# Altium schematic sheet Плакат.SchDoc
size 840 x 594 mm; Address1: Address1; Address2: Address2; Address3: Address3; Address4: Address4; SheetNumber: 1; Scale: 1:1; Разраб.: Иванов; Обозначение документа: АБВГ.123456.001 Э3; Пров.: Петров; Утв.: Сидоров; Наименование организации: ОАО "Концерн "МПО-Гидроприбор"; Перв. применение: АБВГ.123456.000; Наименование изделия 1: Плата; Наименование изделия 2: Схема электрическая; Наименование изделия 3: принципиальная; Нач. отд.: Нач. отд.; Фамилия нач. отд.: Сидоров
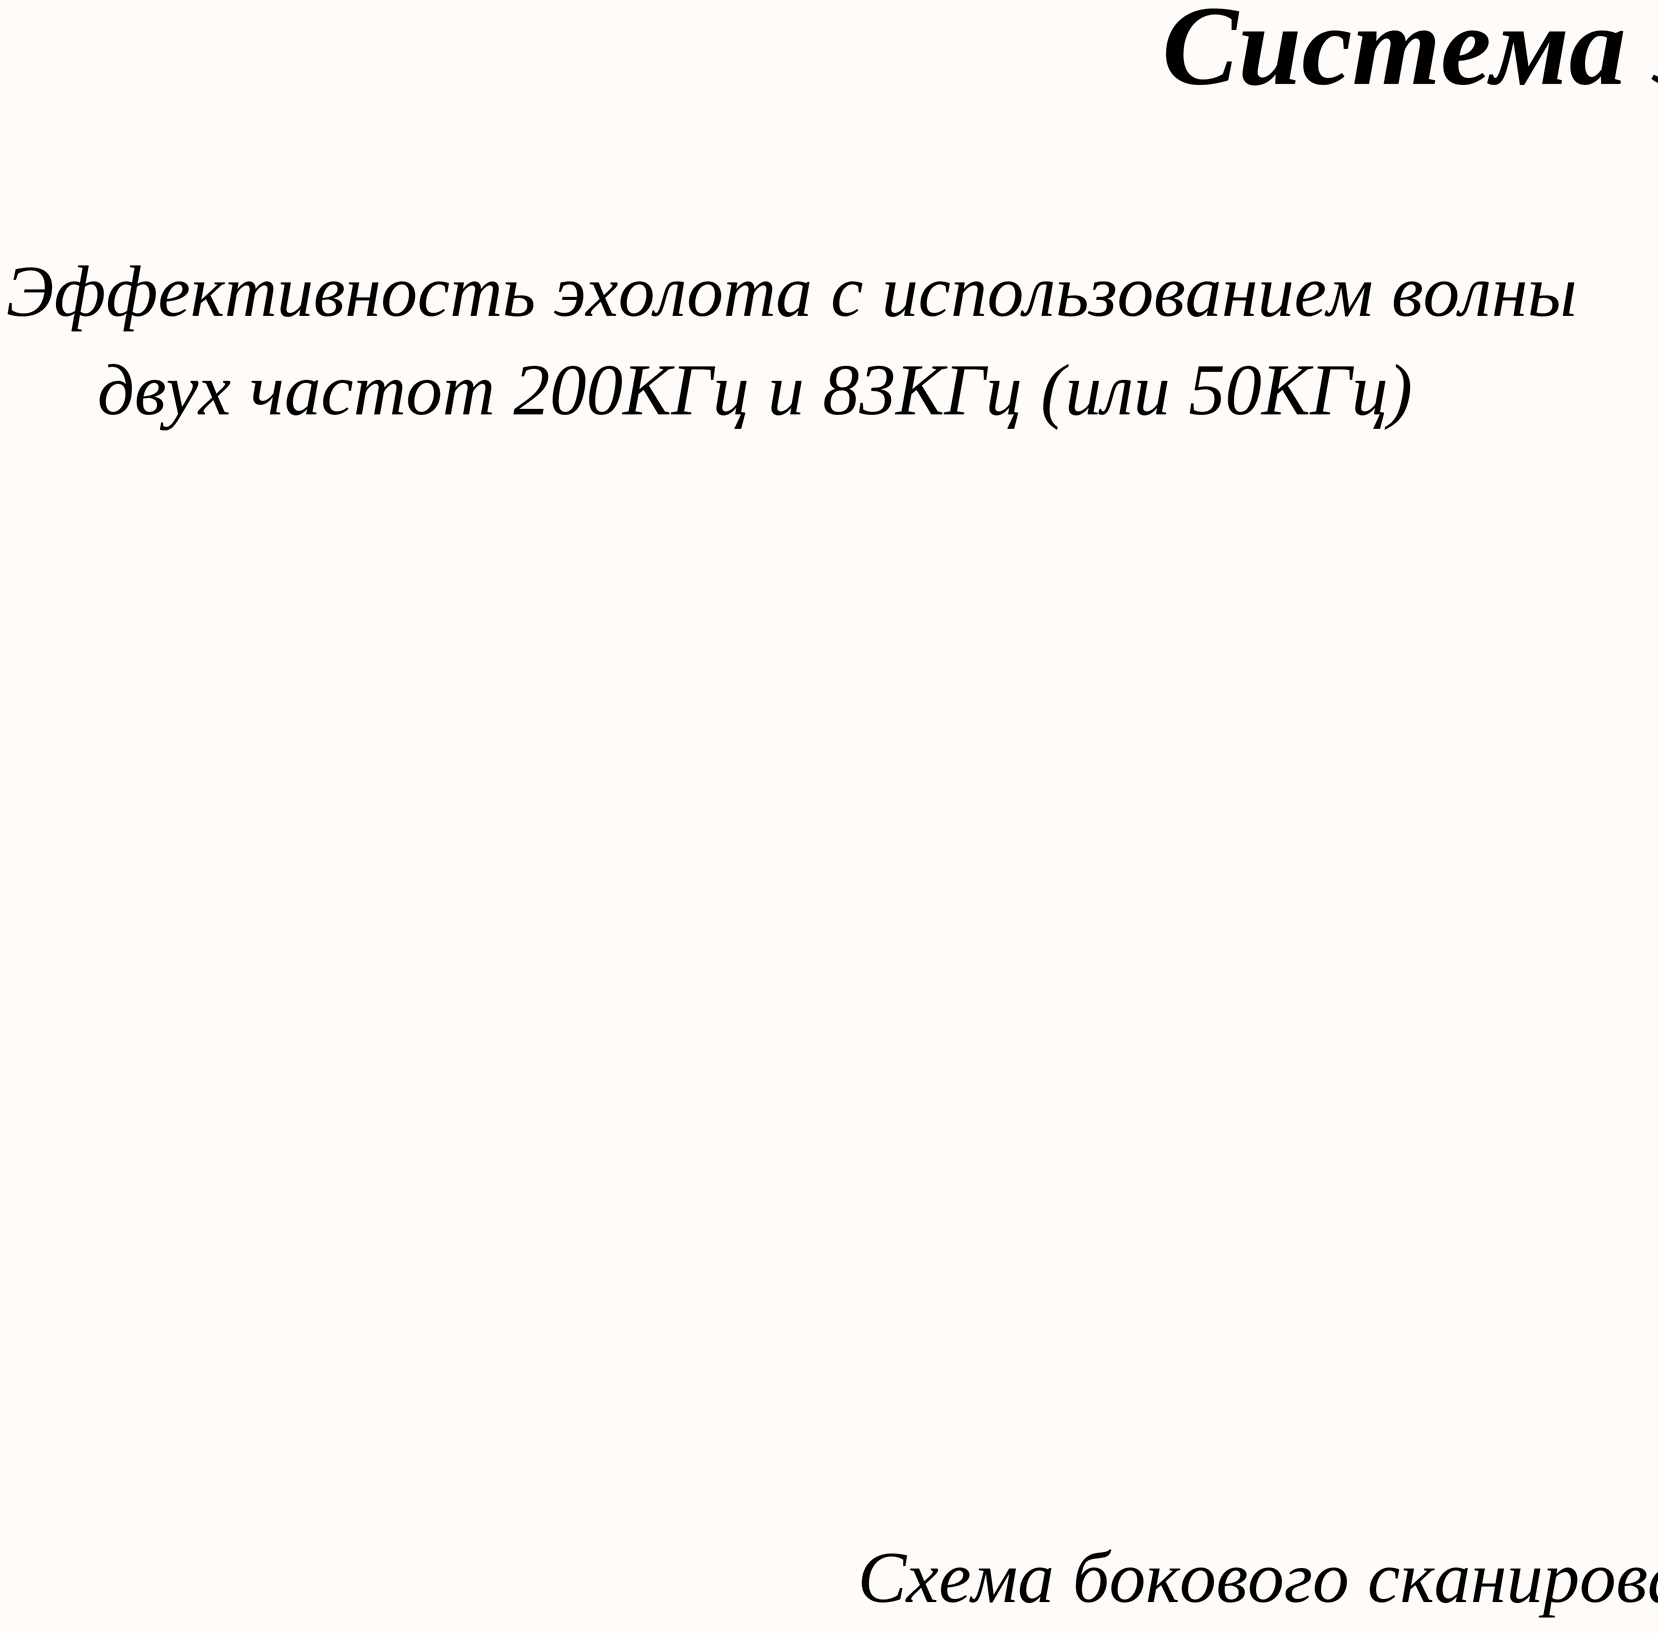
[diagram p0: Плакат.SchDoc, left]
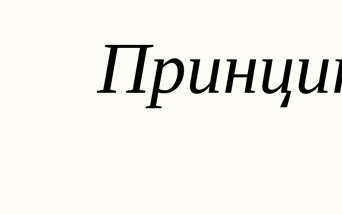
[diagram p1: Плакат.SchDoc, middle]
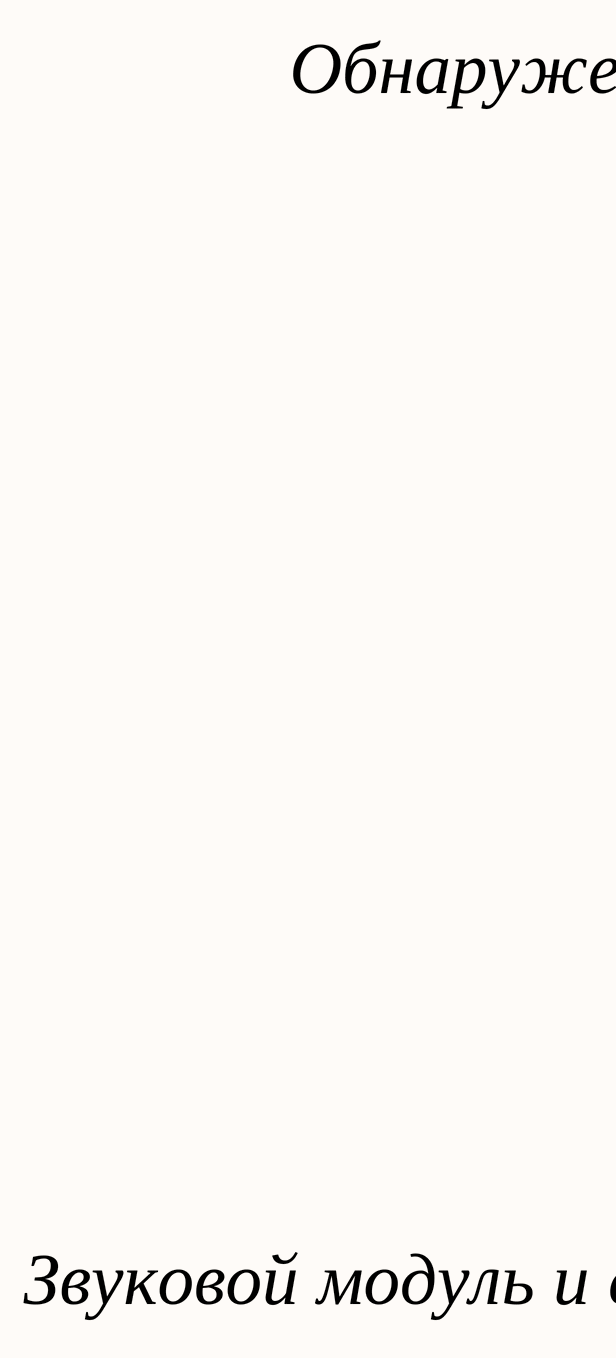
[diagram p2: Плакат.SchDoc, right]

## Notes on the sheet
- Система эхолокации с звуковым модулем
- Эффективность эхолота с использованием волны
- Принцип работы эхолота
- Обнаружение рыбы с помощью эхолота
- двух частот 200КГц и 83КГц (или 50КГц)
- Схема бокового сканирования рыбы
- Звуковой модуль и сигнализатор поклёвки